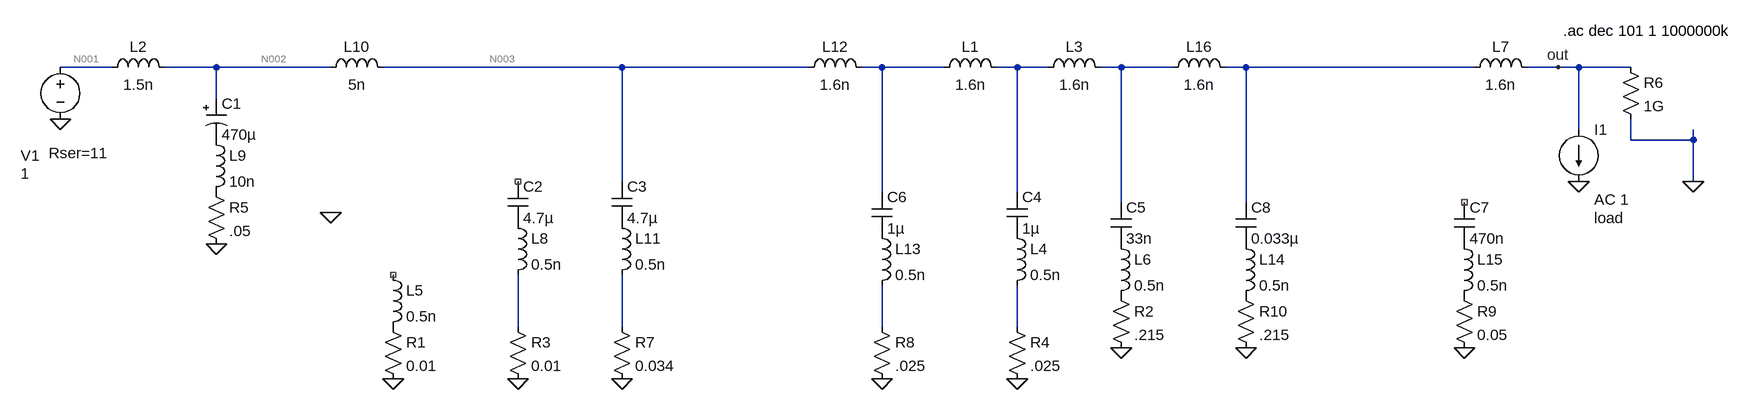
[diagram p0: schematic pdn2.asc]
pdn2.asc, the LTspice schematic file:
Version 4
SHEET 1 1916 724
WIRE -592 144 -672 144
WIRE -432 144 -512 144
WIRE -256 144 -432 144
WIRE 192 144 -176 144
WIRE 480 144 192 144
WIRE 592 144 560 144
WIRE 688 144 592 144
WIRE 800 144 768 144
WIRE 848 144 800 144
WIRE 960 144 928 144
WIRE 1040 144 960 144
WIRE 1152 144 1120 144
WIRE 1504 144 1152 144
WIRE 1632 144 1584 144
WIRE 1664 144 1632 144
WIRE 1744 144 1664 144
WIRE -432 192 -432 144
WIRE 1664 240 1664 144
WIRE 1744 256 1744 224
WIRE 1840 256 1840 240
WIRE 1840 256 1744 256
WIRE 192 320 192 144
WIRE 1840 320 1840 256
WIRE 592 336 592 144
WIRE 800 336 800 144
WIRE 960 352 960 144
WIRE 1152 352 1152 144
WIRE 32 544 32 464
WIRE 192 544 192 464
WIRE 592 544 592 480
WIRE 800 544 800 480
FLAG -672 224 0
FLAG -160 624 0
FLAG 960 576 0
FLAG 1664 320 0
FLAG -256 368 0
FLAG 32 624 0
FLAG 800 624 0
FLAG 1632 144 out
FLAG -432 416 0
FLAG 1840 320 0
FLAG 192 624 0
FLAG 592 624 0
FLAG 1488 576 0
FLAG 1152 576 0
SYMBOL voltage -672 128 R0
WINDOW 39 -18 148 Left 2
WINDOW 0 -61 152 Left 2
WINDOW 3 -61 180 Left 2
SYMATTR SpiceLine Rser=11
SYMATTR InstName V1
SYMATTR Value 1
SYMBOL ind 672 160 R270
WINDOW 0 32 56 VTop 2
WINDOW 3 5 56 VBottom 2
SYMATTR InstName L1
SYMATTR Value 1.6n
SYMBOL ind -608 160 R270
WINDOW 0 32 56 VTop 2
WINDOW 3 5 56 VBottom 2
SYMATTR InstName L2
SYMATTR Value 1.5n
SYMBOL ind -176 448 R0
SYMATTR InstName L5
SYMATTR Value 0.5n
SYMBOL ind 944 400 R0
SYMATTR InstName L6
SYMATTR Value 0.5n
SYMBOL ind 784 384 R0
SYMATTR InstName L4
SYMATTR Value 0.5n
SYMBOL current 1664 240 R0
WINDOW 3 24 80 Invisible 2
WINDOW 123 24 108 Left 2
WINDOW 39 24 136 Left 2
SYMATTR Value ""
SYMATTR Value2 AC 1
SYMATTR SpiceLine load
SYMATTR InstName I1
SYMBOL res 944 480 R0
SYMATTR InstName R2
SYMATTR Value .215
SYMBOL ind 1488 160 R270
WINDOW 0 32 56 VTop 2
WINDOW 3 5 56 VBottom 2
SYMATTR InstName L7
SYMATTR Value 1.6n
SYMBOL ind 16 368 R0
SYMATTR InstName L8
SYMATTR Value 0.5n
SYMBOL res -176 528 R0
SYMATTR InstName R1
SYMATTR Value 0.01
SYMBOL res 16 528 R0
SYMATTR InstName R3
SYMATTR Value 0.01
SYMBOL res 784 528 R0
SYMATTR InstName R4
SYMATTR Value .025
SYMBOL polcap -448 192 R0
WINDOW 3 24 56 Left 2
SYMATTR Value 470µ
SYMATTR InstName C1
SYMATTR Description Capacitor
SYMATTR Type cap
SYMBOL ind -448 240 R0
SYMATTR InstName L9
SYMATTR Value 10n
SYMBOL res -448 320 R0
SYMATTR InstName R5
SYMATTR Value .05
SYMBOL ind -272 160 R270
WINDOW 0 32 56 VTop 2
WINDOW 3 5 56 VBottom 2
SYMATTR InstName L10
SYMATTR Value 5n
SYMBOL res 1728 128 R0
SYMATTR InstName R6
SYMATTR Value 1G
SYMBOL ind 176 368 R0
SYMATTR InstName L11
SYMATTR Value 0.5n
SYMBOL res 176 528 R0
SYMATTR InstName R7
SYMATTR Value 0.034
SYMBOL cap 16 320 R0
SYMATTR InstName C2
SYMATTR Value 4.7µ
SYMBOL cap 176 320 R0
SYMATTR InstName C3
SYMATTR Value 4.7µ
SYMATTR SpiceLine V=6.3 Irms=9.29 Rser=0.00646575 Lser=0 mfg="KEMET" pn="C0603C475K9PAC" type="X5R"
SYMBOL cap 784 336 R0
SYMATTR InstName C4
SYMATTR Value 1µ
SYMBOL cap 944 352 R0
SYMATTR InstName C5
SYMATTR Value 33n
SYMBOL ind 464 160 R270
WINDOW 0 32 56 VTop 2
WINDOW 3 5 56 VBottom 2
SYMATTR InstName L12
SYMATTR Value 1.6n
SYMBOL ind 576 384 R0
SYMATTR InstName L13
SYMATTR Value 0.5n
SYMBOL res 576 528 R0
SYMATTR InstName R8
SYMATTR Value .025
SYMBOL cap 576 336 R0
SYMATTR InstName C6
SYMATTR Value 1µ
SYMBOL ind 1472 400 R0
SYMATTR InstName L15
SYMATTR Value 0.5n
SYMBOL res 1472 480 R0
SYMATTR InstName R9
SYMATTR Value 0.05
SYMBOL cap 1472 352 R0
SYMATTR InstName C7
SYMATTR Value 470n
SYMBOL ind 832 160 R270
WINDOW 0 32 56 VTop 2
WINDOW 3 5 56 VBottom 2
SYMATTR InstName L3
SYMATTR Value 1.6n
SYMBOL ind 1136 400 R0
SYMATTR InstName L14
SYMATTR Value 0.5n
SYMBOL res 1136 480 R0
SYMATTR InstName R10
SYMATTR Value .215
SYMBOL cap 1136 352 R0
SYMATTR InstName C8
SYMATTR Value 0.033µ
SYMBOL ind 1024 160 R270
WINDOW 0 32 56 VTop 2
WINDOW 3 5 56 VBottom 2
SYMATTR InstName L16
SYMATTR Value 1.6n
TEXT 1640 88 Left 2 !.ac dec 101 1 1000000k

The netlist it stands for:
* pdn2.asc
V1 N001 0 1 Rser=11
L1 N004 N005 1.6n
L2 N001 N002 1.5n
L5 NC_01 P001 0.5n
L6 P002 P003 0.5n
L4 P004 N011 0.5n
I1 out 0 AC 1 load
R2 P003 0 .215
L7 N007 out 1.6n
L8 P005 N008 0.5n
R1 P001 0 0.01
R3 N008 0 0.01
R4 N011 0 .025
C1 N002 P006 470µ
L9 P006 P007 10n
R5 P007 0 .05
L10 N002 N003 5n
R6 out 0 1G
L11 P008 N009 0.5n
R7 N009 0 0.034
C2 NC_02 P005 4.7µ
C3 N003 P008 4.7µ V=6.3 Irms=9.29 Rser=0.00646575 Lser=0 mfg="KEMET" pn="C0603C475K9PAC" type="X5R"
C4 N005 P004 1µ
C5 N006 P002 33n
L12 N003 N004 1.6n
L13 P009 N010 0.5n
R8 N010 0 .025
C6 N004 P009 1µ
L15 P010 P011 0.5n
R9 P011 0 0.05
C7 NC_03 P010 470n
L3 N005 N006 1.6n
L14 P012 P013 0.5n
R10 P013 0 .215
C8 N007 P012 0.033µ
L16 N006 N007 1.6n
.ac dec 101 1 1000000k
.backanno
.end

* Results of the author's LTspice run, read from the files saved beside the schematic
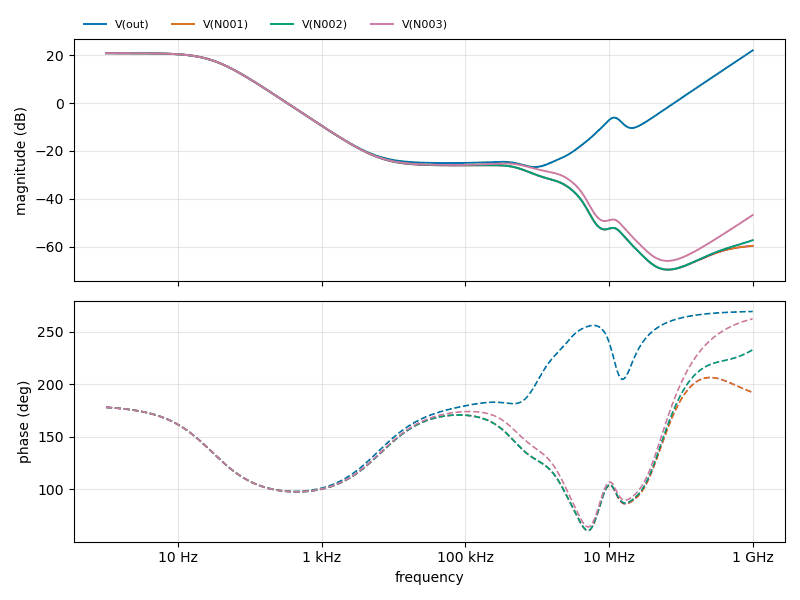
[diagram p1: AC Analysis of pdn2.asc, plotted from the saved traces]
* AC Analysis, 1 run:
*   V(out): 20.83 dB at 1 Hz, 21.98 dB at 1 GHz, peak 21.98 dB at 1 GHz, 3 dB below the peak at 707.2 MHz
*   V(N001): 20.82 dB at 1 Hz, -59.69 dB at 1 GHz, peak 20.82 dB at 1 Hz, 3 dB below the peak at 30.24 Hz
*   V(N002): 20.82 dB at 1 Hz, -57.30 dB at 1 GHz, peak 20.82 dB at 1 Hz, 3 dB below the peak at 30.24 Hz
*   V(N003): 20.82 dB at 1 Hz, -46.81 dB at 1 GHz, peak 20.82 dB at 1 Hz, 3 dB below the peak at 30.24 Hz